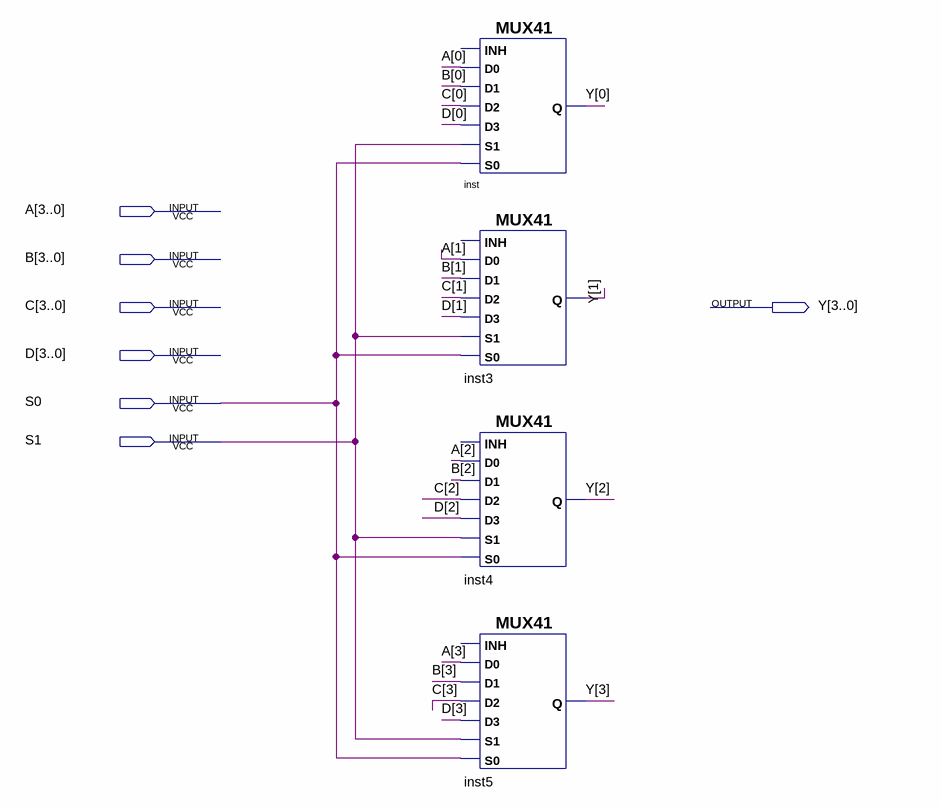
[diagram p0: schematic sheet]
// Quartus schematic mux.bdf as structural Verilog: 4 symbols, 7 pins
module mux (
  input  [3:0] A,
  input  [3:0] B,
  input  [3:0] C,
  input  [3:0] D,
  input  S0,
  input  S1,
  output [3:0] Y
);

  MUX41 inst (.S0(S0), .D2(C[0]), .S1(S1), .D3(D[0]), .D0(A[0]), .D1(B[0]), .Q(Y[0]));  // open: INH
  MUX41 inst3 (.S0(S0), .D2(C[1]), .S1(S1), .D3(D[1]), .D0(A[1]), .D1(B[1]), .Q(Y[1]));  // open: INH
  MUX41 inst4 (.S0(S0), .D2(C[2]), .S1(S1), .D3(D[2]), .D0(A[2]), .D1(B[2]), .Q(Y[2]));  // open: INH
  MUX41 inst5 (.S0(S0), .D2(C[3]), .S1(S1), .D3(D[3]), .D0(A[3]), .D1(B[3]), .Q(Y[3]));  // open: INH
endmodule
